# Altium schematic sheet Bucaneve_single_board.SchDoc: =ProjectName+'_'+ProjectRevision+'_'+VariantName
size A3; DocumentNumber: 1; SheetNumber: 1; SheetTotal: 5
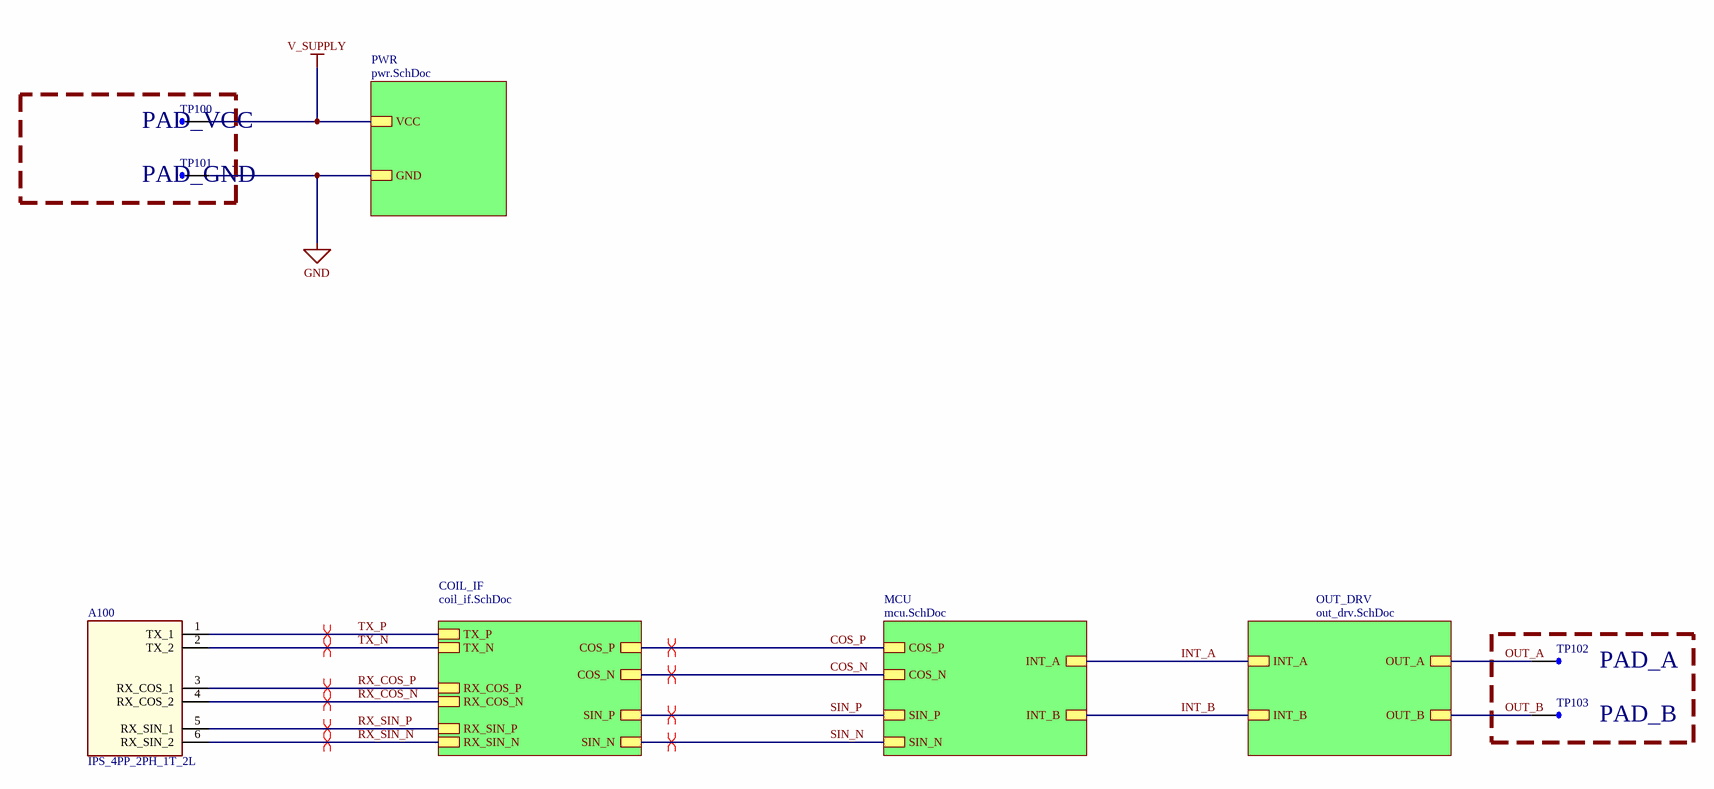
[diagram p0: Bucaneve_single_board.SchDoc]

## Parts
A100  IPS_4PP_2PH_1T_2L  [IPS_4PP_2PH_2T_2L4_4TX045_EXT]
TP100  Test Point  [TSTPNT_SMD_RECT_2x6]  (value not drawn)  (no BOM)
TP101  Test Point  [TSTPNT_SMD_RECT_2x6]  (value not drawn)  (no BOM)
TP102  Test Point  [TSTPNT_SMD_RECT_2x6]  (value not drawn)  (no BOM)
TP103  Test Point  [TSTPNT_SMD_RECT_2x6]  (value not drawn)  (no BOM)

## Sub-sheets
COIL_IF = coil_if.SchDoc: COS_P, COS_N, TX_P, TX_N, RX_COS_N, RX_COS_P, SIN_N, SIN_P, RX_SIN_P, RX_SIN_N
MCU = mcu.SchDoc: INT_A, INT_B, COS_P, COS_N, SIN_N, SIN_P
OUT_DRV = out_drv.SchDoc: OUT_A, OUT_B, INT_A, INT_B
PWR = pwr.SchDoc: GND, VCC

## Nets
GND: TP101.1 ; sheet PWR/GND
V_SUPPLY: TP100.1 ; sheet PWR/VCC
COS_N: sheet MCU/COS_N, sheet COIL_IF/COS_N
COS_P: sheet MCU/COS_P, sheet COIL_IF/COS_P
INT_A: sheet OUT_DRV/INT_A, sheet MCU/INT_A
INT_B: sheet OUT_DRV/INT_B, sheet MCU/INT_B
OUT_A: TP102.1 ; sheet OUT_DRV/OUT_A
OUT_B: TP103.1 ; sheet OUT_DRV/OUT_B
RX_COS_N: A100.4(RX_COS_2) ; sheet COIL_IF/RX_COS_N
RX_COS_P: A100.3(RX_COS_1) ; sheet COIL_IF/RX_COS_P
RX_SIN_N: A100.6(RX_SIN_2) ; sheet COIL_IF/RX_SIN_N
RX_SIN_P: A100.5(RX_SIN_1) ; sheet COIL_IF/RX_SIN_P
SIN_N: sheet MCU/SIN_N, sheet COIL_IF/SIN_N
SIN_P: sheet MCU/SIN_P, sheet COIL_IF/SIN_P
TX_N: A100.2(TX_2) ; sheet COIL_IF/TX_N
TX_P: A100.1(TX_1) ; sheet COIL_IF/TX_P

## Layout directives
differential pair: COS_N, COS_P, RX_COS_N, RX_COS_P, RX_SIN_N, RX_SIN_P, SIN_N, SIN_P, TX_N, TX_P

## Notes on the sheet
- PAD_VCC
- PAD_GND
- PAD_A
- PAD_B
- Proj
- Title:
- Approved:
- Sheet
- File Name:
- Rev:
- Author:
- Date:
- Size:
- A3
- Number:

## Library data of the parts
A100 = IPS_4PP_2PH_2T_2L4_4TX045_EXT: Inductive position sensor, 2 phase, 2 turn, 2Layers 4 Pole pairs; MFG1: PMP; Int Diameter: 39.5mm; Ext Diameter: 63mm; MPN1: IPS_4PP_2PH_2T_2L4_4TX045_EXT; Value: IPS_4PP_2PH_2T_2L
TP100-TP103 = TP_RECT_2x6: Test Point rect 2x5mm; ConnType: TestProbe; MPN1: TP_RECT_2x6; Value: TP_RECT_2x6; Pins: 1; Case/Package: SMD; Orientation: -; Mount: SMD